# Altium project XPIAC-C_1V3.PrjPCB
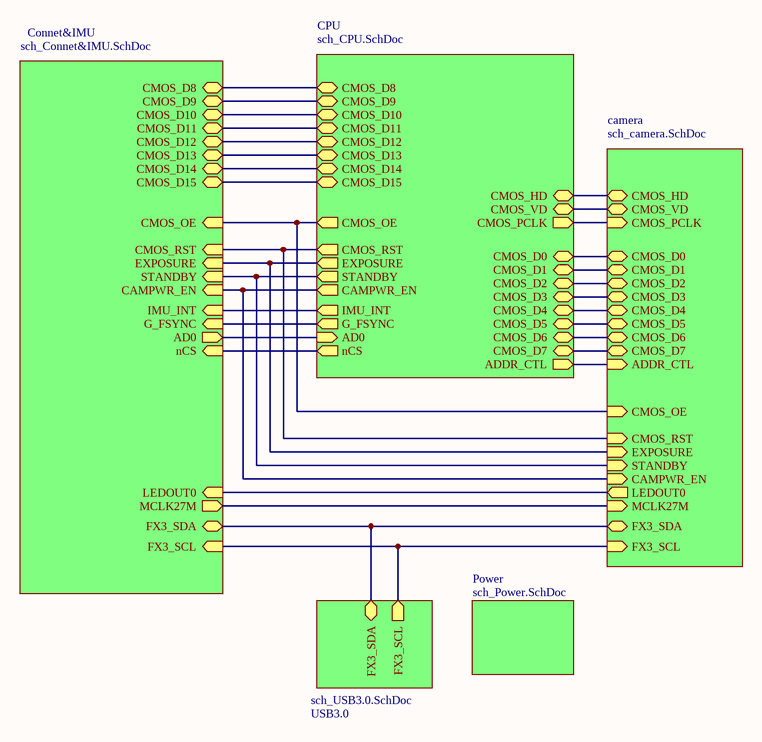
[diagram p0: sch_Top.SchDoc]
4 sheets, 99 parts. Net scope: hierarchical (ports join the sheet entries above them; power ports are global).
Sheets:
  sch_Top.SchDoc
    CPU = sch_CPU.SchDoc
    camera = sch_camera.SchDoc
    USB3.0 = sch_USB3.0.SchDoc

## Sheet sch_Top.SchDoc
size A4

### Sub-sheets
camera = sch_camera.SchDoc: CMOS_D0 (bidir), CMOS_D1 (bidir), CMOS_D2 (bidir), CMOS_D3 (bidir), CMOS_D4 (bidir), CMOS_D5 (bidir), CMOS_D6 (bidir), CMOS_D7 (bidir), CAMPWR_EN (in), CMOS_HD (bidir), CMOS_VD (bidir), CMOS_OE (in), CMOS_PCLK (in), CMOS_RST (in), EXPOSURE (in), STANDBY (in), ADDR_CTL (in), FX3_SCL (in), FX3_SDA (bidir), MCLK27M (in), LEDOUT0 (out)
Connet&IMU = sch_Connet&IMU.SchDoc (file not in this document): FX3_SCL (in), AD0 (out), nCS (in), STANDBY (in), EXPOSURE (in), CMOS_OE (in), CAMPWR_EN (in), CMOS_RST (in), FX3_SDA (bidir), CMOS_D8 (bidir), CMOS_D9 (bidir), CMOS_D10 (bidir), CMOS_D11 (bidir), CMOS_D12 (bidir), CMOS_D13 (bidir), CMOS_D14 (bidir), CMOS_D15 (bidir), IMU_INT (in), G_FSYNC (in), MCLK27M (out), LEDOUT0 (in)
CPU = sch_CPU.SchDoc: AD0 (in), ADDR_CTL (out), CAMPWR_EN (out), CMOS_D0 (bidir), CMOS_D1 (bidir), CMOS_D2 (bidir), CMOS_D3 (bidir), CMOS_D4 (bidir), CMOS_D5 (bidir), CMOS_D6 (bidir), CMOS_D7 (bidir), CMOS_D8 (bidir), CMOS_D9 (bidir), CMOS_D10 (bidir), CMOS_D11 (bidir), CMOS_D12 (bidir), CMOS_D13 (bidir), CMOS_D14 (bidir), CMOS_D15 (bidir), CMOS_HD (bidir), CMOS_VD (bidir), CMOS_OE (out), CMOS_PCLK (out), CMOS_RST (out), EXPOSURE (out), IMU_INT (out), G_FSYNC (out), STANDBY (out), nCS (out)
Power = sch_Power.SchDoc (file not in this document): no entries
USB3.0 = sch_USB3.0.SchDoc: FX3_SDA (bidir), FX3_SCL (out)

### Nets
AD0: sheet CPU/AD0, sheet Connet&IMU/AD0
ADDR_CTL: sheet CPU/ADDR_CTL, sheet camera/ADDR_CTL
CAMPWR_EN: sheet CPU/CAMPWR_EN, sheet Connet&IMU/CAMPWR_EN, sheet camera/CAMPWR_EN
CMOS_D0: sheet CPU/CMOS_D0, sheet camera/CMOS_D0
CMOS_D1: sheet CPU/CMOS_D1, sheet camera/CMOS_D1
CMOS_D2: sheet CPU/CMOS_D2, sheet camera/CMOS_D2
CMOS_D3: sheet CPU/CMOS_D3, sheet camera/CMOS_D3
CMOS_D4: sheet CPU/CMOS_D4, sheet camera/CMOS_D4
CMOS_D5: sheet CPU/CMOS_D5, sheet camera/CMOS_D5
CMOS_D6: sheet CPU/CMOS_D6, sheet camera/CMOS_D6
CMOS_D7: sheet CPU/CMOS_D7, sheet camera/CMOS_D7
CMOS_D8: sheet CPU/CMOS_D8, sheet Connet&IMU/CMOS_D8
CMOS_D9: sheet CPU/CMOS_D9, sheet Connet&IMU/CMOS_D9
CMOS_D10: sheet CPU/CMOS_D10, sheet Connet&IMU/CMOS_D10
CMOS_D11: sheet CPU/CMOS_D11, sheet Connet&IMU/CMOS_D11
CMOS_D12: sheet CPU/CMOS_D12, sheet Connet&IMU/CMOS_D12
CMOS_D13: sheet CPU/CMOS_D13, sheet Connet&IMU/CMOS_D13
CMOS_D14: sheet CPU/CMOS_D14, sheet Connet&IMU/CMOS_D14
CMOS_D15: sheet CPU/CMOS_D15, sheet Connet&IMU/CMOS_D15
CMOS_HD: sheet CPU/CMOS_HD, sheet camera/CMOS_HD
CMOS_OE: sheet CPU/CMOS_OE, sheet Connet&IMU/CMOS_OE, sheet camera/CMOS_OE
CMOS_PCLK: sheet CPU/CMOS_PCLK, sheet camera/CMOS_PCLK
CMOS_RST: sheet CPU/CMOS_RST, sheet Connet&IMU/CMOS_RST, sheet camera/CMOS_RST
CMOS_VD: sheet CPU/CMOS_VD, sheet camera/CMOS_VD
EXPOSURE: sheet CPU/EXPOSURE, sheet Connet&IMU/EXPOSURE, sheet camera/EXPOSURE
FX3_SCL: sheet Connet&IMU/FX3_SCL, sheet camera/FX3_SCL, sheet USB3.0/FX3_SCL
FX3_SDA: sheet Connet&IMU/FX3_SDA, sheet camera/FX3_SDA, sheet USB3.0/FX3_SDA
G_FSYNC: sheet CPU/G_FSYNC, sheet Connet&IMU/G_FSYNC
IMU_INT: sheet CPU/IMU_INT, sheet Connet&IMU/IMU_INT
LEDOUT0: sheet Connet&IMU/LEDOUT0, sheet camera/LEDOUT0
MCLK27M: sheet Connet&IMU/MCLK27M, sheet camera/MCLK27M
nCS: sheet CPU/nCS, sheet Connet&IMU/nCS
STANDBY: sheet CPU/STANDBY, sheet Connet&IMU/STANDBY, sheet camera/STANDBY

## Sheet sch_CPU.SchDoc
size A4
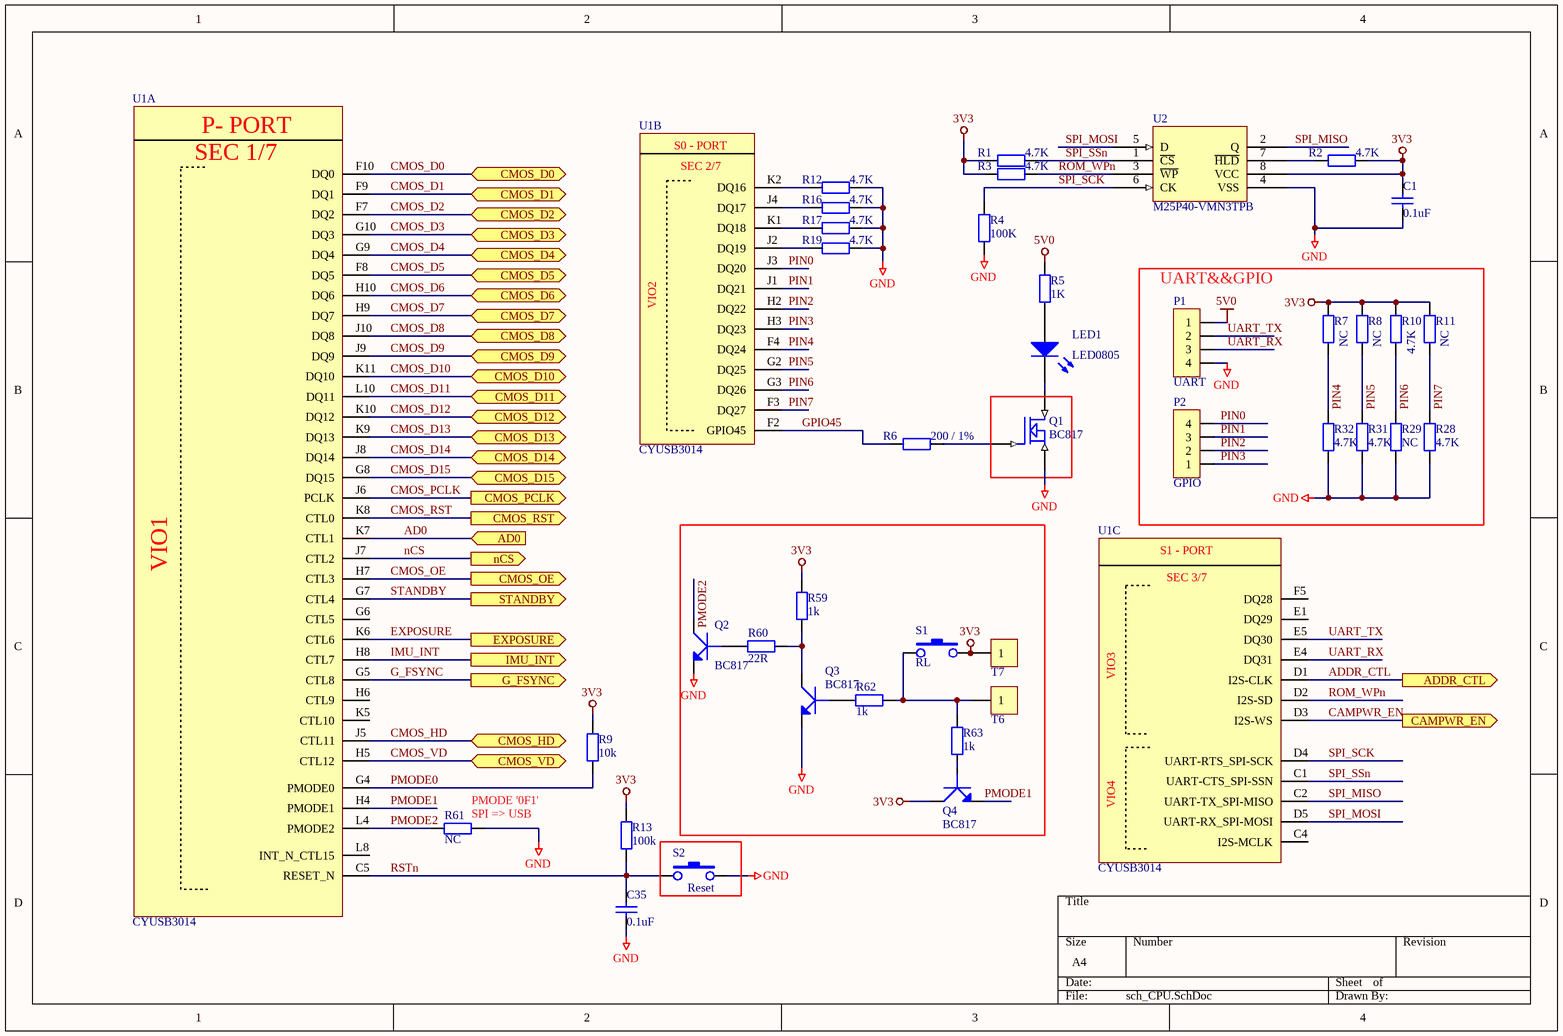
[diagram p1: sch_CPU.SchDoc]

### Parts
C1  0.1uF  [0402C]
C35  0.1uF  [0402C]
LED1  LED0805  [LED0805A_L210W100H60]
P1  UART  [WAFER4_P1.25L6.25W3.4H4.3]
P2  GPIO  [WAFER4_P1.25L6.25W3.4H4.3]
Q1  BC817  [SOT-23L]
Q2  BC817  [SOT-23L]
Q3  BC817  [SOT-23L]
Q4  BC817  [SOT-23L]
R1  4.7K  [0402R]
R2  4.7K  [0402R]
R3  4.7K  [0402R]
R4  100K  [0402R]
R5  1K  [0402R]
R6  value 200 / 1%  [0402R]  (hidden comment: 200R)
R7  NC  [0402R]
R8  NC  [0402R]
R9  10K  [0402R]
R10  4.7K  [0402R]
R11  NC  [0402R]
R12  4.7K  [0402R]
R13  100K  [0402R]
R16  4.7K  [0402R]
R17  4.7K  [0402R]
R19  4.7K  [0402R]
R28  4.7K  [0402R]
R29  NC  [0402R]
R31  4.7K  [0402R]
R32  4.7K  [0402R]
R59  1K  [0402R]
R60  22R  [0402R]
R61  NC  [0805R]
R62  1k  [0402R]
R63  1k  [0402R]
S1  RL  [SW_L40W30H25_MPTFP]
S2  Reset  [SW_L40W30H25_MPTFP]
T6  CON1  [PAD_TP_D1.2]  (value not drawn)
T7  CON1  [PAD_TP_D1.2]  (value not drawn)
U1  CYUSB3014  [FBGA121_P80L100W100H11]  (parts A,B,C of 7)
U2  M25P40-VMN3TPB  [SO8N_P127L50W40W62H17]

### Blocks framed on the sheet
UART&&GPIO: P1 P2 R7 R8 R10 R11 R28 R29 R31 R32

### Ports
AD0 (in), ADDR_CTL (out), CAMPWR_EN (out), CMOS_D0 (bidir), CMOS_D1 (bidir), CMOS_D2 (bidir), CMOS_D3 (bidir), CMOS_D4 (bidir), CMOS_D5 (bidir), CMOS_D6 (bidir), CMOS_D7 (bidir), CMOS_D8 (bidir), CMOS_D9 (bidir), CMOS_D10 (bidir), CMOS_D11 (bidir), CMOS_D12 (bidir), CMOS_D13 (bidir), CMOS_D14 (bidir), CMOS_D15 (bidir), CMOS_HD (bidir), CMOS_OE (out), CMOS_PCLK (out), CMOS_RST (out), CMOS_VD (bidir), EXPOSURE (out), G_FSYNC (out), IMU_INT (out), nCS (out), STANDBY (out)

### Nets
3V3: C1.2 Q4.3(C) R1.1 R2.2 R3.1 R7.2 R8.2 R9.1 R10.2 R11.2 R13.1 R59.2 S1.1 T7.1 U2.8(VCC)
5V0: P1.1 R5.1
GND: C1.1 C35.1 P1.4 Q1.2(S) Q2.2(E) Q3.2(E) R4.1 R12.2 R16.2 R17.2 R19.2 R28.2 R29.2 R31.2 R32.2 R61.1 S2.2 U2.4(VSS)
AD0: U1.K7(CTL1) ; port AD0
ADDR_CTL: U1.D1(I2S-CLK) ; port ADDR_CTL
CAMPWR_EN: U1.D3(I2S-WS) ; port CAMPWR_EN
CMOS_D0: U1.F10(DQ0) ; port CMOS_D0
CMOS_D1: U1.F9(DQ1) ; port CMOS_D1
CMOS_D2: U1.F7(DQ2) ; port CMOS_D2
CMOS_D3: U1.G10(DQ3) ; port CMOS_D3
CMOS_D4: U1.G9(DQ4) ; port CMOS_D4
CMOS_D5: U1.F8(DQ5) ; port CMOS_D5
CMOS_D6: U1.H10(DQ6) ; port CMOS_D6
CMOS_D7: U1.H9(DQ7) ; port CMOS_D7
CMOS_D8: U1.J10(DQ8) ; port CMOS_D8
CMOS_D9: U1.J9(DQ9) ; port CMOS_D9
CMOS_D10: U1.K11(DQ10) ; port CMOS_D10
CMOS_D11: U1.L10(DQ11) ; port CMOS_D11
CMOS_D12: U1.K10(DQ12) ; port CMOS_D12
CMOS_D13: U1.K9(DQ13) ; port CMOS_D13
CMOS_D14: U1.J8(DQ14) ; port CMOS_D14
CMOS_D15: U1.G8(DQ15) ; port CMOS_D15
CMOS_HD: U1.J5(CTL11) ; port CMOS_HD
CMOS_OE: U1.H7(CTL3) ; port CMOS_OE
CMOS_PCLK: U1.J6(PCLK) ; port CMOS_PCLK
CMOS_RST: U1.K8(CTL0) ; port CMOS_RST
CMOS_VD: U1.H5(CTL12) ; port CMOS_VD
EXPOSURE: U1.K6(CTL6) ; port EXPOSURE
G_FSYNC: U1.G5(CTL8) ; port G_FSYNC
GPIO45: R6.1 U1.F2(GPIO45)
IMU_INT: U1.H8(CTL7) ; port IMU_INT
nCS: U1.J7(CTL2) ; port nCS
PIN0: P2.4 U1.J3(DQ20)
PIN1: P2.3 U1.J1(DQ21)
PIN2: P2.2 U1.H2(DQ22)
PIN3: P2.1 U1.H3(DQ23)
PIN4: R7.1 R32.1 U1.F4(DQ24)
PIN5: R8.1 R31.1 U1.G2(DQ25)
PIN6: R10.1 R29.1 U1.G3(DQ26)
PIN7: R11.1 R28.1 U1.F3(DQ27)
PMODE0: R9.2 U1.G4(PMODE0)
PMODE1: Q4.2(E) U1.H4(PMODE1)
PMODE2: Q2.3(C) R61.2 U1.L4(PMODE2)
ROM_WPn: R3.2 U1.D2(I2S-SD) U2.3(~{WP})
RSTn: C35.2 R13.2 S2.1 U1.C5(RESET_N)
SPI_MISO: U1.C2(UART-TX_SPI-MISO) U2.2(Q)
SPI_MOSI: U1.D5(UART-RX_SPI-MOSI) U2.5(D)
SPI_SCK: R4.2 U1.D4(UART-RTS_SPI-SCK) U2.6(CK)
SPI_SSn: R1.2 U1.C1(UART-CTS_SPI-SSN) U2.1(~{CS})
STANDBY: U1.G7(CTL4) ; port STANDBY
UART_RX: P1.3 U1.E4(DQ31)
UART_TX: P1.2 U1.E5(DQ30)
NetLED1_1: LED1.1(A) R5.2
NetLED1_2: LED1.2(K) Q1.3(D)
NetQ1_1: Q1.1(G) R6.2
NetQ2_1: Q2.1(B) R60.1
NetQ3_1: Q3.1(B) R62.2
NetQ3_3: Q3.3(C) R59.1 R60.2
NetQ4_1: Q4.1(B) R63.2
NetR2_1: R2.1 U2.7(~{HLD})
NetR12_1: R12.1 U1.K2(DQ16)
NetR16_1: R16.1 U1.J4(DQ17)
NetR17_1: R17.1 U1.K1(DQ18)
NetR19_1: R19.1 U1.J2(DQ19)
NetR62_1: R62.1 R63.1 S1.2 T6.1

Not connected (* = marked no-connect by the designer): U1 C4(I2S-MCLK) E1(DQ29) F5(DQ28) G6(CTL5) H6(CTL9) K5(CTL10) L8(INT_N_CTL15)

### Notes on the sheet
- (near R61) PMODE '0F1'
- (near R61) SPI => USB
- (in symbol CYUSB3014, part A) P- PORT; SEC 1/7; VIO1
- (in symbol CYUSB3014, part B) S0 - PORT; SEC 2/7
- (in symbol CYUSB3014, part C) S1 - PORT; SEC 3/7

### Library data of the parts
C1 C35 = Cap: Capacitor; Published: 8-Jun-2000; LatestRevisionDate: 17-Jul-2002; LatestRevisionNote: Re-released for DXP Platform.; PackageReference: RAD-0.3; Publisher: Altium Limited; Value: 0.1uF
LED1 = LED: 发光二级管
P1 P2 = CON4
Q1 = MOSFET N
Q2-Q4 = NPN: NPN Transistor
R1-R13 R16 R17 R19 R28 R29 R31 R32 R59 R61-R63 = Resistor: Published: 8-Jun-2000; LatestRevisionDate: 17-Jul-2002; LatestRevisionNote: Re-released for DXP Platform.; PackageReference: AXIAL-0.4; Publisher: Altium Limited
  R1-R3 R10 R12 R16 R17 R19 R28 R31 R32: Value: 4.7K
  R4: Value: 100K
  R5: Value: 1K
  R7 R8 R11 R29 R61: Value: NC
  R9: Value: 10k
  R13: Value: 100k
  R59 R62 R63: Value: 1k
R60 = Resistor: Value: 10k; Published: 8-Jun-2000; LatestRevisionDate: 17-Jul-2002; LatestRevisionNote: Re-released for DXP Platform.; PackageReference: AXIAL-0.4; Publisher: Altium Limited
S1 S2 = Button_sop: Value: BUTTON
T6 T7 = CON1: Connector

## Sheet sch_camera.SchDoc
size A4
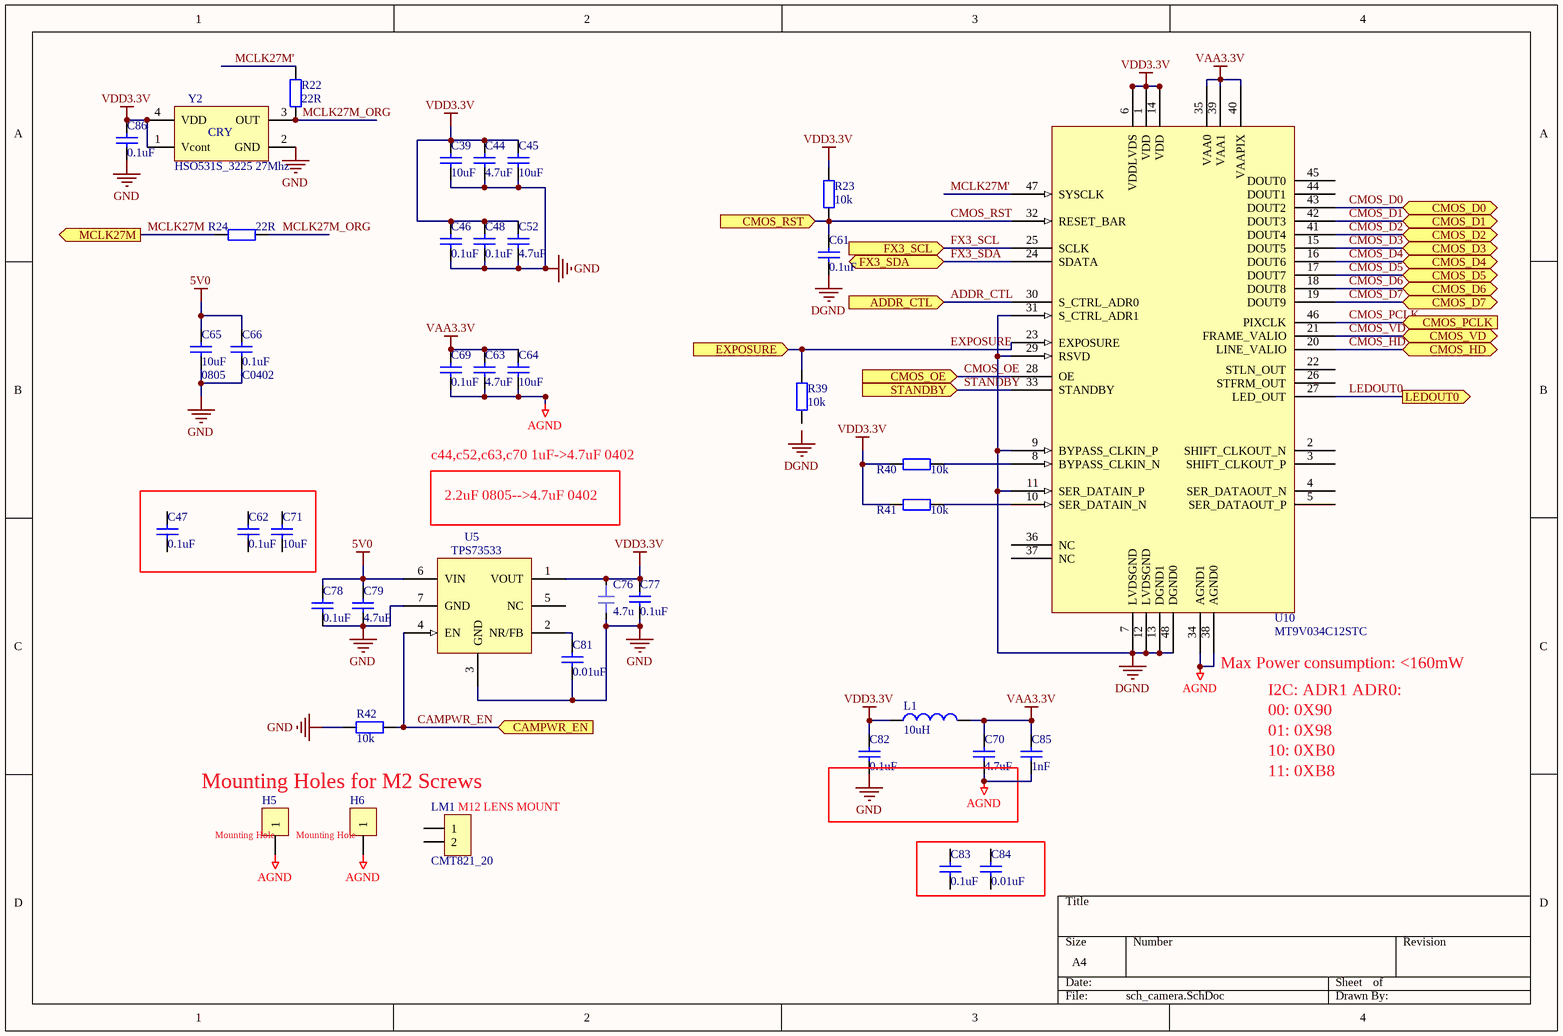
[diagram p2: sch_camera.SchDoc]

### Parts
C39  10uF  [0805C]
C44  4.7uF  [0402C]
C45  10uF  [0805C]
C46  0.1uF  [0402C]
C47  0.1uF  [0402C]
C48  0.1uF  [0402C]
C52  4.7uF  [0402C]
C61  0.1uF  [0402C]
C62  0.1uF  [0402C]
C63  4.7uF  [0402C]
C64  10uF  [0805C]
C65  10uF  value 0805  [0805C]
C66  0.1uF  value C0402  [0402C]
C69  0.1uF  [0402C]
C70  4.7uF  [0402C]
C71  10uF  [0805C]
C76  4.7u  [0402C_L]
C77  0.1uF  [0402C_L]
C78  0.1uF  [0402C]
C79  value 4.7uF  [0402C_L]  (hidden comment: 1uF)
C81  0.01uF  [0402C_L]
C82  0.1uF  [0402C_L]
C83  0.1uF  [0402C_L]
C84  0.01uF  [0402C_L]
C85  1nF  [0402C_L]
C86  0.1uF  [0402C_L]
H5  CON1  [PAD_M3_D350_450]  (value not drawn)
H6  CON1  [PAD_M3_D350_450]  (value not drawn)
L1  10uH  [0805R]
LM1  CMT821_20  [PAD_M3_D350_450]
R22  value 22R  [0402R_L]  (hidden comment: 0R)
R23  10K  [0402R]
R24  22R  [0402R]
R39  10K  [0402R]
R40  10K  [0402R]
R41  10K  [0402R]
R42  10K  [0402R_L]
U5  TPS73533  [SON6_P65L21W21H8_DRV]
U10  MT9V034C12STC  [CLCC48_P80L114W114H23]
Y2  HSO531S_3225 27Mhz  [XTAL_3225]

### Ports
ADDR_CTL (in), CAMPWR_EN (in), CMOS_D0 (bidir), CMOS_D1 (bidir), CMOS_D2 (bidir), CMOS_D3 (bidir), CMOS_D4 (bidir), CMOS_D5 (bidir), CMOS_D6 (bidir), CMOS_D7 (bidir), CMOS_HD (bidir), CMOS_OE (in), CMOS_PCLK (in), CMOS_RST (in), CMOS_VD (bidir), EXPOSURE (in), FX3_SCL (in), FX3_SDA (bidir), LEDOUT0 (out), MCLK27M (out), STANDBY (in)

### Nets
5V0: C65.2 C66.2 C78.2 C79.2 U5.6(VIN)
AGND: C63.1 C64.1 C69.1 C70.1 C85.1 H5.1 H6.1 U10.34(AGND1) U10.38(AGND0)
DGND: C61.1 U10.7(LVDSGND) U10.9(BYPASS_CLKIN_P) U10.11(SER_DATAIN_P) U10.12(LVDSGND) U10.13(DGND1) U10.29(RSVD) U10.31(S_CTRL_ADR1) U10.48(DGND0)
GND: C39.1 C44.1 C45.1 C46.1 C48.1 C52.1 C65.1 C66.1 C76.2 C77.1 C78.1 C79.1 C81.1 C82.1 C86.1 R42.2 U5.3(GND) U5.7(GND) Y2.2(GND)
VAA3.3V: C63.2 C64.2 C69.2 C70.2 C85.2 L1.2 U10.35(VAA0) U10.39(VAA1) U10.40(VAAPIX)
VDD3.3V: C39.2 C44.2 C45.2 C46.2 C48.2 C52.2 C76.1 C77.2 C82.2 C86.2 L1.1 R23.2 R40.2 R41.2 U5.1(VOUT) U10.1(VDD) U10.6(VDDLVDS) U10.14(VDD) Y2.1(Vcont) Y2.4(VDD)
ADDR_CTL: U10.30(S_CTRL_ADR0) ; port ADDR_CTL
CAMPWR_EN: R42.1 U5.4(EN) ; port CAMPWR_EN
CMOS_D0: U10.43(DOUT2) ; port CMOS_D0
CMOS_D1: U10.42(DOUT3) ; port CMOS_D1
CMOS_D2: U10.41(DOUT4) ; port CMOS_D2
CMOS_D3: U10.15(DOUT5) ; port CMOS_D3
CMOS_D4: U10.16(DOUT6) ; port CMOS_D4
CMOS_D5: U10.17(DOUT7) ; port CMOS_D5
CMOS_D6: U10.18(DOUT8) ; port CMOS_D6
CMOS_D7: U10.19(DOUT9) ; port CMOS_D7
CMOS_HD: U10.20(LINE_VALIO) ; port CMOS_HD
CMOS_OE: U10.28(OE) ; port CMOS_OE
CMOS_PCLK: U10.46(PIXCLK) ; port CMOS_PCLK
CMOS_RST: C61.2 R23.1 U10.32(RESET_BAR) ; port CMOS_RST
CMOS_VD: U10.21(FRAME_VALIO) ; port CMOS_VD
EXPOSURE: R39.1 U10.23(EXPOSURE) ; port EXPOSURE
FX3_SCL: U10.25(SCLK) ; port FX3_SCL
FX3_SDA: U10.24(SDATA) ; port FX3_SDA
LEDOUT0: U10.27(LED_OUT) ; port LEDOUT0
MCLK27M: R24.1 ; port MCLK27M
MCLK27M': R22.1 U10.47(SYSCLK)
MCLK27M_ORG: R22.2 R24.2 Y2.3(OUT)
STANDBY: U10.33(STANDBY) ; port STANDBY
NetC81_2: C81.2 U5.2(NR/FB)
NetR40_1: R40.1 U10.8(BYPASS_CLKIN_N)
NetR41_1: R41.1 U10.10(SER_DATAIN_N)

Not connected (* = marked no-connect by the designer): C47 1 2; C62 1 2; C71 1 2; C83 1 2; C84 1 2; LM1 1 2; R39 2; U5 5(NC); U10 2(SHIFT_CLKOUT_N) 3(SHIFT_CLKOUT_P) 4(SER_DATAOUT_N) 5(SER_DATAOUT_P) 22(STLN_OUT) 26(STFRM_OUT) 36(NC) 37(NC) 44(DOUT1) 45(DOUT0)

### Notes on the sheet
- c44,c52,c63,c70 1uF->4.7uF 0402
- 2.2uF 0805-->4.7uF 0402
- (near U10) Max Power consumption: <160mW
- I2C: ADR1 ADR0:
- 00: 0X90
- Mounting Holes for M2 Screws
- 01: 0X98
- 10: 0XB0
- 11: 0XB8
- (near H5) Mounting Hole
- (near H6) Mounting Hole
- (near LM1) M12 LENS MOUNT
- Labels drawn without touching a wire or pin: DGND

### Library data of the parts
C39 C44-C48 C52 C61-C66 C69-C71 C77-C79 C81-C86 = Cap: Capacitor; Published: 8-Jun-2000; LatestRevisionDate: 17-Jul-2002; LatestRevisionNote: Re-released for DXP Platform.; Publisher: Altium Limited
  C39 C45 C64 C71: PackageReference: RAD-0.3; Value: 10uF
  C44 C52 C63 C70: PackageReference: RAD-0.3; Value: 4.7uF
  C46-C48 C61 C62 C69 C77 C78 C82 C83 C86: Value: 0.1uF
  C65 C79: PackageReference: RAD-0.3
  C81: PackageReference: RAD-0.3; Value: 0.01uF
  C84: Value: 0.01uF
  C85: Value: 1nF
C76 = cap0402: CC0402MRX5R5BB475; 元件类别: 贴片电容; 主物料厂家: YAGEO
H5 H6 = CON1: Connector
L1 = Inductor: Value: 330mH
LM1 = CON2: Connector
R22-R24 R39-R42 = Resistor: Published: 8-Jun-2000; LatestRevisionDate: 17-Jul-2002; LatestRevisionNote: Re-released for DXP Platform.; PackageReference: AXIAL-0.4; Publisher: Altium Limited
  R23 R39-R42: Value: 10k
  R24: Value: 22R
U10 = MT9V034
Y2 = CRY: 有源晶振

## Sheet sch_USB3.0.SchDoc
size A4
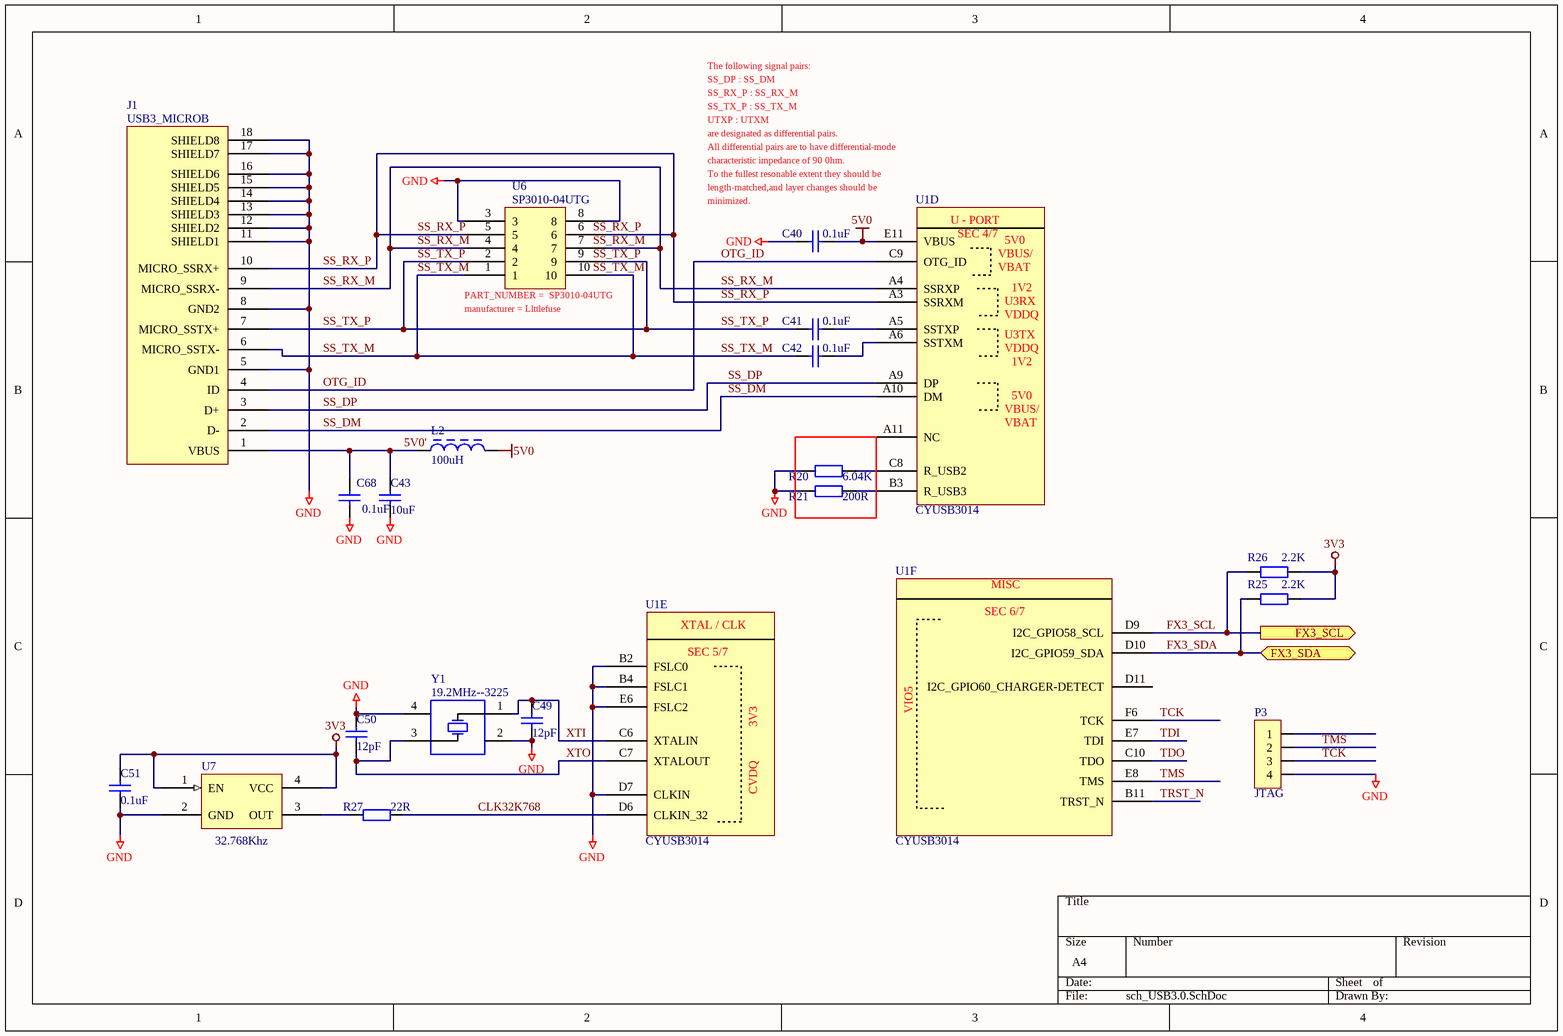
[diagram p3: sch_USB3.0.SchDoc]

### Parts
C40  0.1uF  [0402C]
C41  0.1uF  [0402C]
C42  0.1uF  [0402C]
C43  10uF  [0805C]
C49  12pF  [0402C]
C50  12pF  [0402C]
C51  0.1uF  [0402C]
C68  0.1uF  [0402C]
J1  USB3_MICROB  [USB3_BA_P65L130W51H28]
L2  100uH  [L_P3D6H9]
P3  JTAG  [WAFER4_P1.25L6.25W3.4H4.3]
R20  6.04K  [0402R]
R21  200R  [0402R]
R25  2.2K  [0402R]
R26  2.2K  [0402R]
R27  22R  [0402R]
U1  CYUSB3014  [FBGA121_P80L100W100H11]  (parts D,E,F of 7)
U6  SP3010-04UTG  [UDFN10_SON_P50L25W10H55]
U7  XTAL-3225  [XTAL_3225]  (value not drawn)
Y1  19.2MHz--3225  [XTAL_3225]

### Ports
FX3_SCL (out), FX3_SDA (bidir)

### Nets
3V3: C51.2 R25.1 R26.1 U7.1(EN) U7.4(VCC)
5V0: C40.1 L2.2 U1.E11(VBUS)
GND: C40.2 C43.1 C49.1 C50.2 C51.1 C68.2 J1.5(GND1) J1.8(GND2) J1.11(SHIELD1) J1.12(SHIELD2) J1.13(SHIELD3) J1.14(SHIELD4) J1.15(SHIELD5) J1.16(SHIELD6) J1.17(SHIELD7) J1.18(SHIELD8) P3.4 R20.2 R21.2 U1.B2(FSLC0) U1.B4(FSLC1) U1.D7(CLKIN) U1.E6(FSLC2) U6.3 U6.8 U7.2(GND) Y1.2 Y1.4
5V0': C43.2 C68.1 J1.1(VBUS) L2.1
CLK32K768: R27.1 U1.D6(CLKIN_32)
FX3_SCL: R26.2 U1.D9(I2C_GPIO58_SCL) ; port FX3_SCL
FX3_SDA: R25.2 U1.D10(I2C_GPIO59_SDA) ; port FX3_SDA
OTG_ID: J1.4(ID) U1.C9(OTG_ID)
SS_DM: J1.2(D-) U1.A10(DM)
SS_DP: J1.3(D+) U1.A9(DP)
SS_RX_M: J1.9(MICRO_SSRX-) U1.A4(SSRXP) U6.4 U6.7
SS_RX_P: J1.10(MICRO_SSRX+) U1.A3(SSRXM) U6.5 U6.6
SS_TX_M: C42.2 J1.6(MICRO_SSTX-) U6.1 U6.10
SS_TX_P: C41.2 J1.7(MICRO_SSTX+) U6.2 U6.9
TCK: P3.3 U1.F6(TCK)
TDI: U1.E7(TDI)
TDO: U1.C10(TDO)
TMS: P3.2 U1.E8(TMS)
TRST_N: U1.B11(TRST_N)
XTI: C49.2 U1.C6(XTALIN) Y1.1
XTO: C50.1 U1.C7(XTALOUT) Y1.3
NetC41_1: C41.1 U1.A5(SSTXP)
NetC42_1: C42.1 U1.A6(SSTXM)
NetR20_1: R20.1 U1.C8(R_USB2)
NetR21_1: R21.1 U1.B3(R_USB3)
NetR27_2: R27.2 U7.3(OUT)

Not connected (* = marked no-connect by the designer): P3 1; U1 A11(NC) D11(I2C_GPIO60_CHARGER-DETECT)

### Notes on the sheet
- The following signal pairs:
- SS_DP : SS_DM
- SS_RX_P : SS_RX_M
- SS_TX_P : SS_TX_M
- UTXP : UTXM
- are designated as differential pairs.
- All differential pairs are to have differential-mode
- characteristic impedance of 90 0hm.
- To the fullest resonable extent they should be
- length-matched,and layer changes should be
- minimized.
- (near U6) PART_NUMBER =  SP3010-04UTG
- (near U6) manufacturer = Llttlefuse
- (near U7) 32.768Khz
- Labels drawn without touching a wire or pin: SS_RX_M, SS_RX_P, SS_TX_M, SS_TX_P
- (in symbol CYUSB3014, part D) U - PORT; SEC 4/7; 5V0; VBUS/; 1V2; U3RX; VDDQ; U3TX
- (in symbol CYUSB3014, part E) XTAL / CLK; SEC 5/7; 3V3; CVDQ
- (in symbol CYUSB3014, part F) MISC; SEC 6/7

### Library data of the parts
C40-C43 C49-C51 C68 = Cap: Capacitor; Published: 8-Jun-2000; LatestRevisionDate: 17-Jul-2002; LatestRevisionNote: Re-released for DXP Platform.; PackageReference: RAD-0.3; Publisher: Altium Limited
  C40-C42 C51 C68: Value: 0.1uF
  C43: Value: 10uF
L2 = L: 7.2.04.0034 立式电感受10uH 2A
P3 = CON4
R20 = Resistor: Value: 43; Published: 8-Jun-2000; LatestRevisionDate: 17-Jul-2002; LatestRevisionNote: Re-released for DXP Platform.; PackageReference: AXIAL-0.4; Publisher: Altium Limited
R21 R25-R27 = Resistor: Published: 8-Jun-2000; LatestRevisionDate: 17-Jul-2002; LatestRevisionNote: Re-released for DXP Platform.; PackageReference: AXIAL-0.4; Publisher: Altium Limited
U7 = XTAL.
Y1 = XTAL: Crystal Oscillator

## Nets that join several sheets
3V3: sch_CPU (15 pins), sch_USB3.0 (5 pins)
5V0: sch_CPU (P1.1 R5.1), sch_camera (5 pins), sch_USB3.0 (C40.1 L2.2 U1.E11)
GND: sch_CPU (18 pins), sch_camera (19 pins), sch_USB3.0 (28 pins)
ADDR_CTL: sch_CPU (U1.D1), sch_camera (U10.30)
CAMPWR_EN: sch_CPU (U1.D3), sch_camera (R42.1 U5.4)
CMOS_D0: sch_CPU (U1.F10), sch_camera (U10.43)
CMOS_D1: sch_CPU (U1.F9), sch_camera (U10.42)
CMOS_D2: sch_CPU (U1.F7), sch_camera (U10.41)
CMOS_D3: sch_CPU (U1.G10), sch_camera (U10.15)
CMOS_D4: sch_CPU (U1.G9), sch_camera (U10.16)
CMOS_D5: sch_CPU (U1.F8), sch_camera (U10.17)
CMOS_D6: sch_CPU (U1.H10), sch_camera (U10.18)
CMOS_D7: sch_CPU (U1.H9), sch_camera (U10.19)
CMOS_HD: sch_CPU (U1.J5), sch_camera (U10.20)
CMOS_OE: sch_CPU (U1.H7), sch_camera (U10.28)
CMOS_PCLK: sch_CPU (U1.J6), sch_camera (U10.46)
CMOS_RST: sch_CPU (U1.K8), sch_camera (C61.2 R23.1 U10.32)
CMOS_VD: sch_CPU (U1.H5), sch_camera (U10.21)
EXPOSURE: sch_CPU (U1.K6), sch_camera (R39.1 U10.23)
FX3_SCL: sch_camera (U10.25), sch_USB3.0 (R26.2 U1.D9)
FX3_SDA: sch_camera (U10.24), sch_USB3.0 (R25.2 U1.D10)
STANDBY: sch_CPU (U1.G7), sch_camera (U10.33)